# EAGLE design pneumatics (EAGLE 8.5.0)
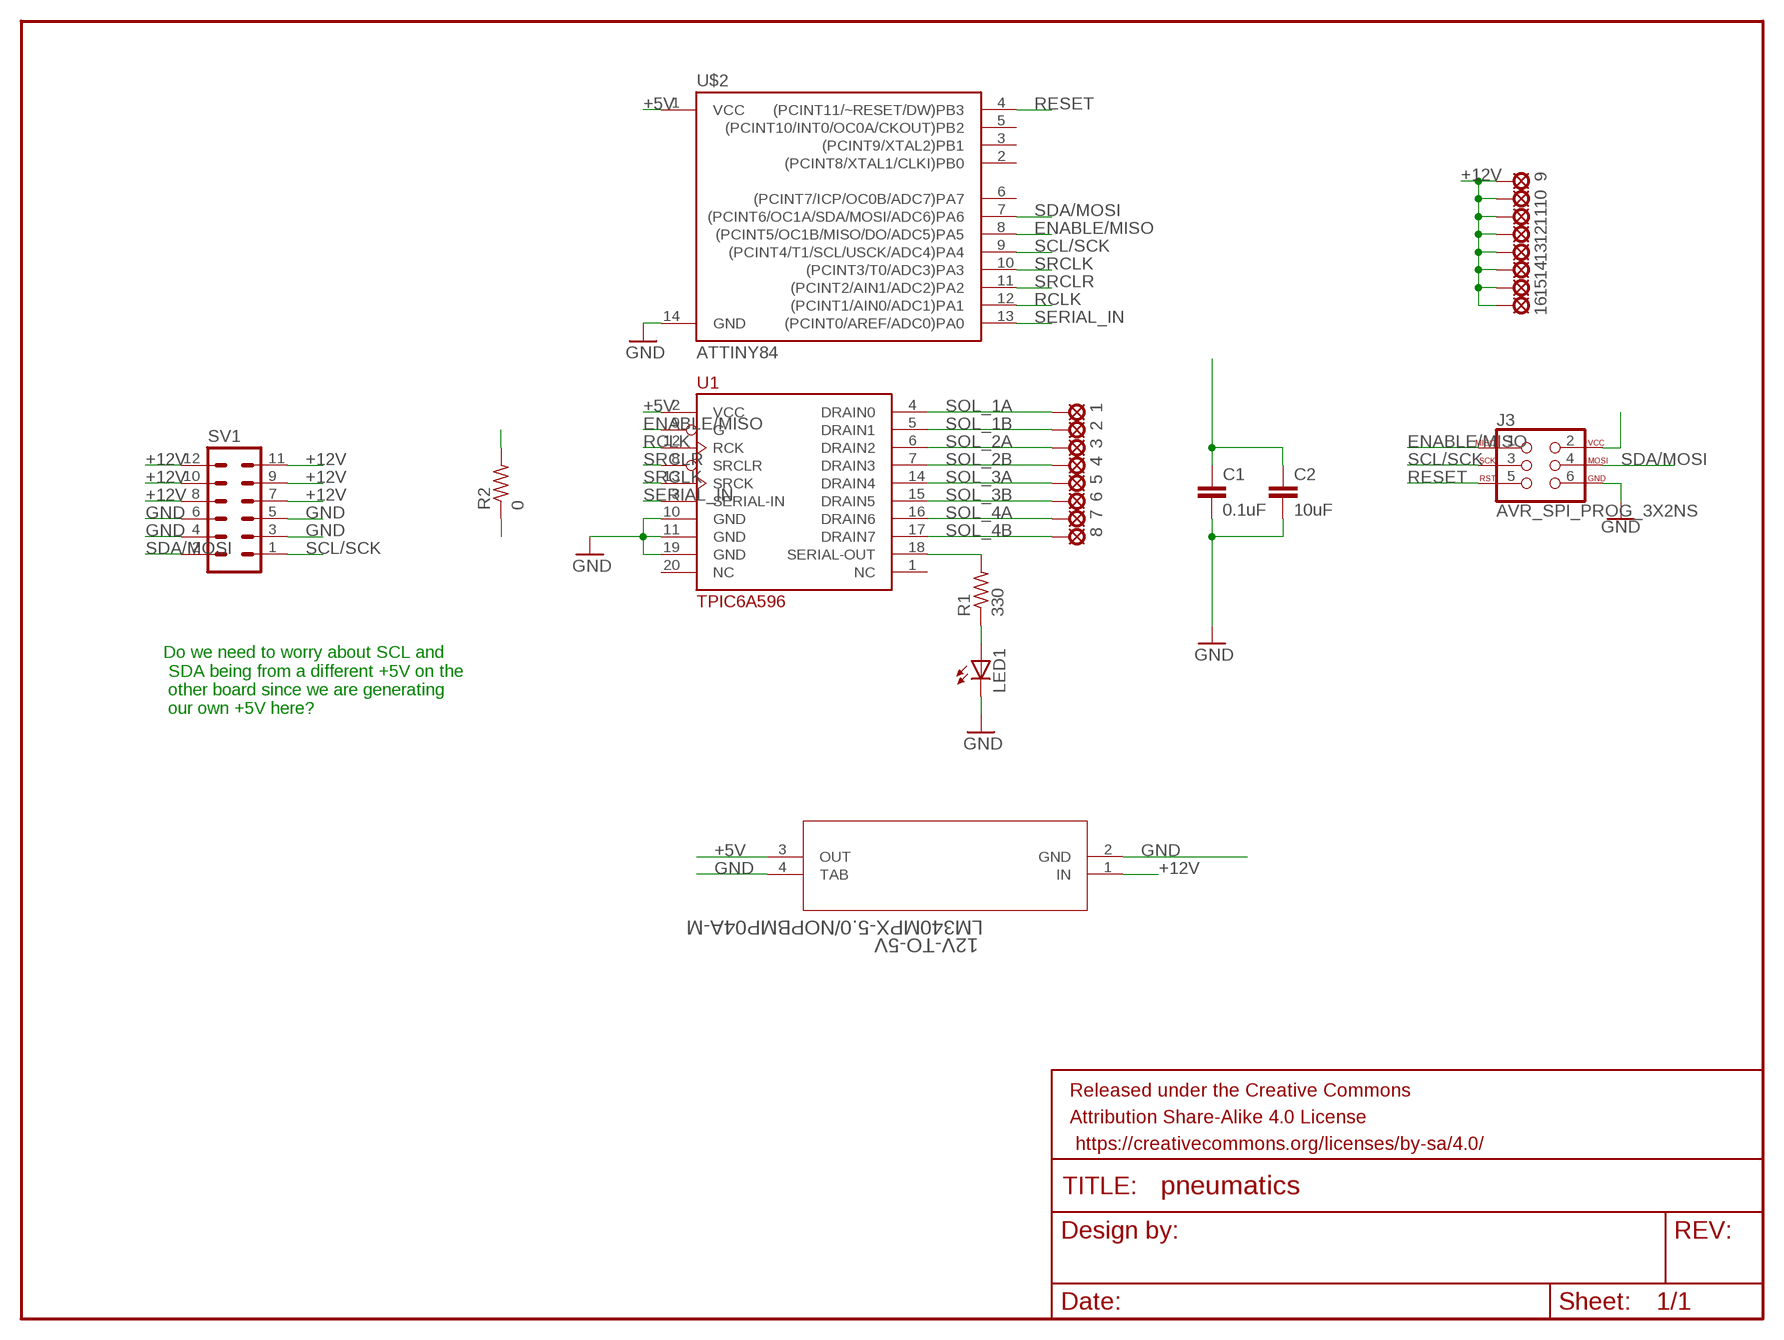
[diagram p0: schematic, sheet 1]

## Parts
1  SE14  [SE14]
2  SE14  [SE14]
3  SE14  [SE14]
4  SE14  [SE14]
5  SE14  [SE14]
6  SE14  [SE14]
7  SE14  [SE14]
8  SE14  [SE14]
9  SE14  [SE14]
10  SE14  [SE14]
11  SE14  [SE14]
12  SE14  [SE14]
12V-TO-5V  LM340MPX-5.0/NOPBMP04A-M  [MP04A-M]
13  SE14  [SE14]
14  SE14  [SE14]
15  SE14  [SE14]
16  SE14  [SE14]
C1  0.1uF  CAP0603-CAP  [0603-CAP]
C2  10uF  CAP0603-CAP  [0603-CAP]
FRAME1  FRAME-LETTERNO_PACKAGE  [DUMMY]
J3  AVR_SPI_PROG_3X2NS  [2X3-NS]
LED1  LED_ESML0603  [LED_SML0603]
R1  330  R-US_R0603  [R0603]
R2  0  R-US_R0603  [R0603]
SV1  MA06-2  [MA06-2]
U1  TPIC6A596  [SOIC20-W]
U$2  ATTINY84  [SO14]

## Nets
+5V: 12V-TO-5V.3(OUT) C1.1 C2.1 J3.2 U1.2(VCC) U$2.1(VCC)
+12V: 9.MP 10.MP 11.MP 12.MP 12V-TO-5V.1(IN) 13.MP 14.MP 15.MP 16.MP SV1.7 SV1.8 SV1.9 SV1.10 SV1.11 SV1.12
ENABLE/MISO: J3.1 U1.9(G) U$2.8((PCINT5/OC1B/MISO/DO/ADC5)PA5)
GND: 12V-TO-5V.2(GND) 12V-TO-5V.4(TAB) C1.2 C2.2 J3.6 LED1.C SV1.3 SV1.4 SV1.5 SV1.6 U1.10(GND) U1.11(GND) U1.19(GND) U$2.14(GND)
N$1: R1.2 U1.18(SERIAL-OUT)
N$7: LED1.A R1.1
RCLK: R2.2 U1.12(RCK) U$2.12((PCINT1/AIN0/ADC1)PA1)
RESET: J3.5 U$2.4((PCINT11/~RESET/DW)PB3)
SCL/SCK: J3.3 SV1.1 U$2.9((PCINT4/T1/SCL/USCK/ADC4)PA4)
SDA/MOSI: J3.4 SV1.2 U$2.7((PCINT6/OC1A/SDA/MOSI/ADC6)PA6)
SERIAL_IN: U1.3(SERIAL-IN) U$2.13((PCINT0/AREF/ADC0)PA0)
SOL_1A: 1.MP U1.4(DRAIN0)
SOL_1B: 2.MP U1.5(DRAIN1)
SOL_2A: 3.MP U1.6(DRAIN2)
SOL_2B: 4.MP U1.7(DRAIN3)
SOL_3A: 5.MP U1.14(DRAIN4)
SOL_3B: 6.MP U1.15(DRAIN5)
SOL_4A: 7.MP U1.16(DRAIN6)
SOL_4B: 8.MP U1.17(DRAIN7)
SRCLK: R2.1 U1.13(SRCK) U$2.10((PCINT3/T0/ADC3)PA3)
SRCLR: U1.8(SRCLR) U$2.11((PCINT2/AIN1/ADC2)PA2)
Unconnected: U1.1(NC) U1.20(NC) U$2.2((PCINT8/XTAL1/CLKI)PB0) U$2.3((PCINT9/XTAL2)PB1) U$2.5((PCINT10/INT0/OC0A/CKOUT)PB2) U$2.6((PCINT7/ICP/OC0B/ADC7)PA7)

## Notes on the sheet
- Do we need to worry about SCL and
   SDA being from a different +5V on the
   other board since we are generating
   our own +5V here?

## Library data of the parts
1-16 = solpad:SE14: SOLDER PAD E1553, drill 1,4mm, distributor Buerklin, 07F820
12V-TO-5V = 12v_to_5v_linreg:LM340MPX-5.0/NOPB; MANUFACTURER_PART_NUMBER: LM340MPX5.0NOPB; VENDOR: National Semiconductor
C1 C2 = SparkFun-Passives:CAP: Capacitor Standard 0603 ceramic capacitor, and 0.1" leaded capacitor.
FRAME1 = SparkFun-Aesthetics:FRAME-LETTER: Schematic Frame - Letter Standard 8.5x11 US Letter frame; DESIGNER: Nobody; VERSION: v01
J3 = SparkFun-Connectors:AVR_SPI_PROG_3X2: AVR ISP 6 Pin This is the reduced ISP connector for AVR programming. Common on Arduino. This footprint will take up less PCB space and can be used with a 10-pin to 6-pin adapter such as SKU: BOB-08508 **Special note about "TEST_POINT" package. The stop mask is on the top side, so if you want your programming test points to be on the bottom of your board, make sure to place this package on the bottom side of the board. This also ensure that the orientation to program from the bottom side will be correct. SparkFun Products: SparkFun ISP Pogo Adapter <https://www.sparkfun.com/products/11591> - NS Tiny AVR Programmer <https://www.sparkfun.com/products/11801> -PTH
LED1 = eagle-ltspice:LED_E: LED Source: http://www.osram.convergy.de Source: www.luxeon.com Source: www.kingbright.com; SPICEMODEL: NONE; SPICEPREFIX: D; SPICETYPE: diode
R1 R2 = resistor:R-US_: RESISTOR, American symbol
SV1 = con-lstb:MA06-2: PIN HEADER; OC_FARNELL: unknown; OC_NEWARK: unknown
U1 = Personal:TPIC6A596
U$2 = SparkFun-IC-Microcontroller:ATTINY84: Atmel 14-pin 2/4/8kB flash uC Datasheet <https://cdn.sparkfun.com/datasheets/Widgets/doc8006.pdf> SparkFun Products Tiny AVR Programmer <https://www.sparkfun.com/products/11801> (PGM-11801) SparkFun Servo Trigger - Continuous Rotation <https://www.sparkfun.com/products/13872> (WIG-13872) SparkFun Servo Trigger <https://www.sparkfun.com/products/13118> (WIG-13118); PROD_ID: IC-11285

## Board
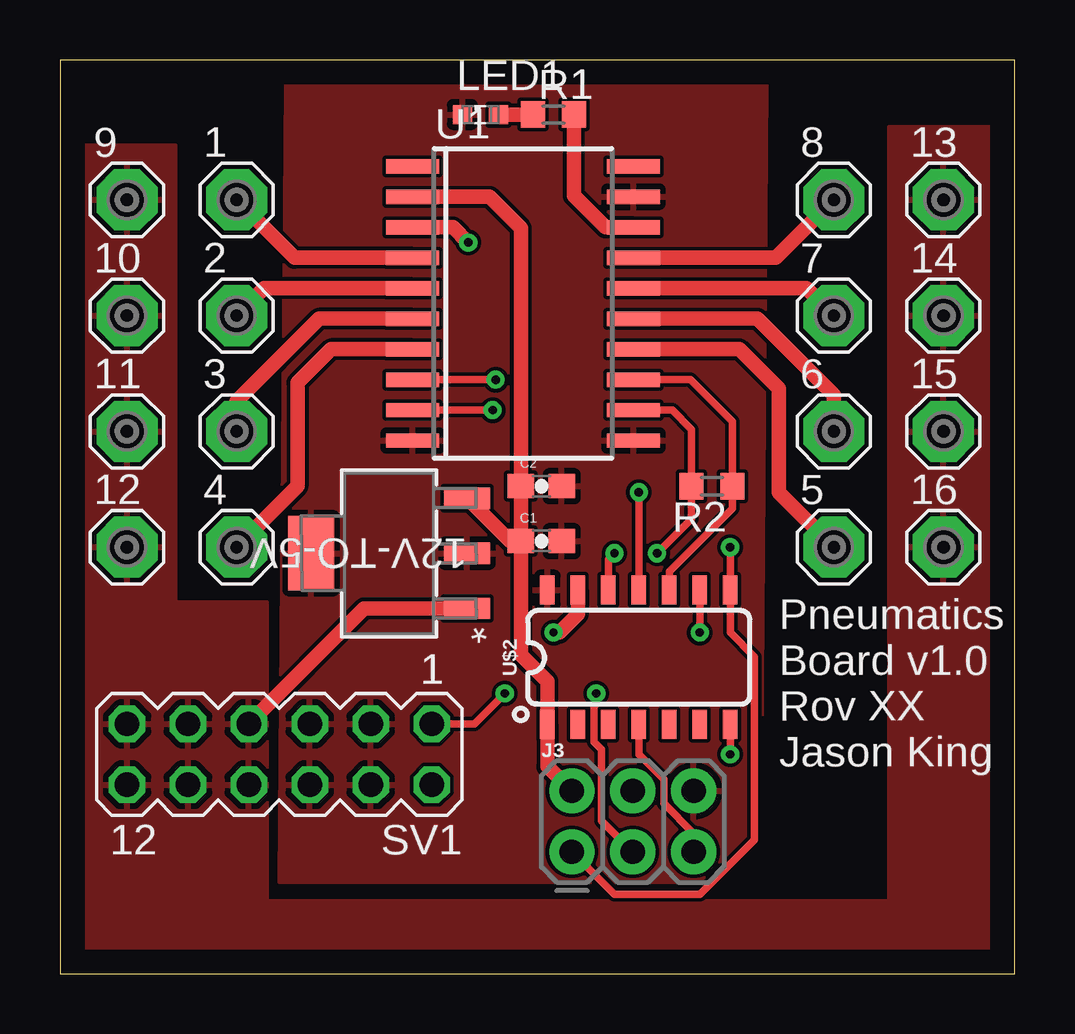
[diagram p1: board, top side]
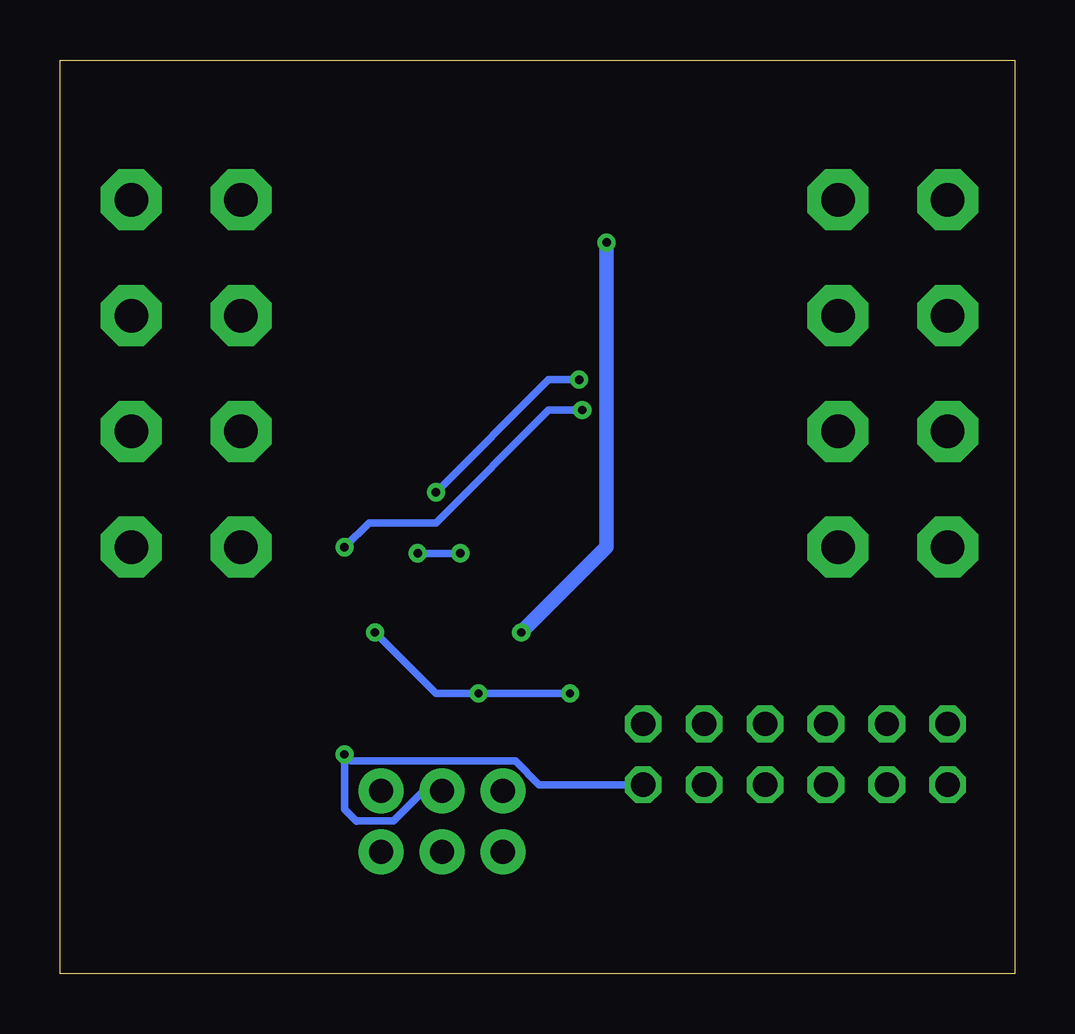
[diagram p2: board, bottom side, seen from below]

Size 39.8 x 38.09 mm. Coordinates in mm from the lower left corner, seen from the top.
Outline: 0,0 39.8,0 39.8,38.09 0,38.09 0,0
Copper layers (1*16): Top 0.035mm / dielectric 1.5mm / Bottom 0.035mm
Design rules "default": minimum track width 6mil, minimum drill 0.35mm, track to track 6mil, track to pad 6mil, pad to pad 6mil, via to via 6mil, smd to smd 6mil, copper to edge 40mil, drill to drill 6mil, minimum pad ring 10mil, minimum via ring 8mil, stop-mask expansion 4mil, vias tented up to drill 0mil, thermal gap 10mil

### Footprints (pad centres in the part's own frame; a part is rotated, then mirrored left to right if it is on the bottom)
SE14 = drill 1.397 pad 2.54 octagon: MP 0,0
MP04A-M = smd 1.905 x 0.889: 1 -3.251,2.3; 2 -3.251,0; 3 -3.251,-2.3 | smd 1.905 x 3.099: 4 3.251,0
0603-CAP = smd 1.1 x 1: 1 -0.85,0; 2 0.85,0
2X3-NS = drill 1.016 pad 1.88: 1 -2.54,-1.27; 2 -2.54,1.27; 3 0,-1.27; 4 0,1.27; 5 2.54,-1.27; 6 2.54,1.27
LED_SML0603 = smd 0.8 x 0.8: A 0.75,0; C -0.75,0
R0603 = smd 1 x 1.1: 1 -0.85,0; 2 0.85,0
MA06-2 = drill 1.016 octagon: 1 -6.35,-1.27; 2 -6.35,1.27; 3 -3.81,-1.27; 4 -3.81,1.27; 5 -1.27,-1.27; 6 -1.27,1.27; 7 1.27,-1.27; 8 1.27,1.27; 9 3.81,-1.27; 10 3.81,1.27; 11 6.35,-1.27; 12 6.35,1.27
SOIC20-W = smd 0.6 x 2.2: 1 -5.715,-4.6; 2 -4.445,-4.6; 3 -3.175,-4.6; 4 -1.905,-4.6; 5 -0.635,-4.6; 6 0.635,-4.6; 7 1.905,-4.6; 8 3.175,-4.6; 9 4.445,-4.6; 10 5.715,-4.6; 11 5.715,4.6; 12 4.445,4.6; 13 3.175,4.6; 14 1.905,4.6; 15 0.635,4.6; 16 -0.635,4.6; 17 -1.905,4.6; 18 -3.175,4.6; 19 -4.445,4.6; 20 -5.715,4.6
SO14 = smd 0.6 x 1.2: 1 -3.175,-2.8; 2 -1.905,-2.8; 3 -0.635,-2.8; 4 0.635,-2.8; 5 1.905,-2.8; 6 3.175,-2.8; 7 4.445,-2.8; 8 4.445,2.8; 9 3.175,2.8; 10 1.905,2.8; 11 0.635,2.8; 12 -0.635,2.8; 13 -1.905,2.8; 14 -3.175,2.8

### Placement (x,y rotation side)
1  7.37,32.26 0 top
2  7.37,27.43 0 top
3  7.37,22.61 0 top
4  7.37,17.78 0 top
5  32.26,17.78 0 top
6  32.26,22.61 0 top
7  32.26,27.43 0 top
8  32.26,32.26 0 top
9  2.79,32.26 0 top
10  2.79,27.43 0 top
11  2.79,22.61 0 top
12  2.79,17.78 0 top
12V-TO-5V  13.72,17.53 180 top
13  36.83,32.26 0 top
14  36.83,27.43 0 top
15  36.83,22.61 0 top
16  36.83,17.78 0 top
C1  20.07,18.03 0 top
C2  20.07,20.32 0 top
FRAME1  -27.94,34.29 0 top  (outside the outline)
J3  23.88,6.35 0 top
LED1  17.53,35.81 0 top
R1  20.57,35.81 0 top
R2  27.18,20.32 180 top
SV1  9.14,9.14 180 top
U1  19.3,27.94 270 top
U$2  23.5,13.2 0 top

### Tracks (layer width: path | path; a pad name or v marks a point on that pad's centre or on a via)
+5V
  Top 0.61: 12V-TO-5V.3 18.76,18.03 C1.1 | C1.1 C2.1 19.22,31.08 17.91,32.38 U1.2 | C1.1 19.22,13.3 20.32,12.19 U$2.1 20.32,8.64 J3.2
+12V
  Top 0.61: 12V-TO-5V.1 12.69,15.23 SV1.7
  pour Top: 0.25,34.54 0.25,0.25 39.88,0.25 39.88,35.31 34.54,35.31 34.54,3.05 8.89,3.05 8.64,3.05 8.64,15.49 4.83,15.49 4.83,34.54
ENABLE/MISO  (via drill 0.35)
  Top 0.305: U1.9 v18.03,23.5 | v27.94,17.78 U$2.8 27.94,14.22 28.96,13.21 28.96,5.59 26.67,3.3 23.11,3.3 J3.1
  Bottom 0.305: v18.03,23.5 19.43,23.5 24.13,18.8 26.92,18.8 v27.94,17.78
GND
  pour Top: 9.4,37.08 29.46,37.08 29.21,3.81 9.14,3.81
N$1
  Top 0.61: U1.18 22.73,31.11 21.42,32.42 R1.2
N$7
  Top 0.61: R1.1 LED1.A
RCLK  (via drill 0.35)
  Top 0.305: U1.12 25.53,23.5 26.33,22.69 R2.2 26.33,18.96 v24.89,17.53 | v23.11,17.53 22.86,17.27 U$2.12
  Bottom 0.305: v23.11,17.53 v24.89,17.53
RESET
  Top 0.305: J3.5 26.42,5.86 25.17,7.1 25.17,8.1 24.13,9.14 U$2.4
SCL/SCK  (via drill 0.35)
  Top 0.305: SV1.1 17.27,10.41 v18.54,11.68 | v26.67,14.22 U$2.9 | v22.35,11.68 22.35,11.22 22.25,11.12 22.25,9.67 22.58,9.34 22.58,6.38 J3.3
  Bottom 0.305: v18.54,11.68 v22.35,11.68 24.13,11.68 v26.67,14.22
SDA/MOSI  (via drill 0.35)
  Top 0.305: v27.94,9.14 U$2.7
  Bottom 0.305: SV1.2 19.83,7.87 20.82,8.87 27.66,8.87 v27.94,9.14 27.94,6.86 27.43,6.35 27.41,6.38 25.9,6.38 24.66,7.62 J3.4
SERIAL_IN  (via drill 0.35)
  Top 0.61: U$2.13 21.59,14.99 20.83,14.22 v20.57,14.22 | U1.3 16.38,31.11 v17.02,30.48
  Bottom 0.61: v20.57,14.22 17.02,17.78 v17.02,30.48
SOL_1A
  Top 0.61: U1.4 9.78,29.84 1.MP
SOL_1B
  Top 0.61: U1.5 8.51,28.57 2.MP
SOL_2A
  Top 0.61: U1.6 10.79,27.3 7.37,23.88 3.MP
SOL_2B
  Top 0.61: U1.7 11.3,26.04 9.91,24.64 9.91,20.32 4.MP
SOL_3A
  Top 0.61: U1.14 28.32,26.04 29.97,24.38 29.97,20.07 5.MP
SOL_3B
  Top 0.61: U1.15 29.08,27.3 32.26,24.13 6.MP
SOL_4A
  Top 0.61: U1.16 31.11,28.57 7.MP
SOL_4B
  Top 0.61: U1.17 29.84,29.84 8.MP
SRCLK
  Top 0.305: U1.13 26.29,24.77 28.03,23.03 R2.1 28.03,19.39 25.4,16.76 U$2.10
SRCLR  (via drill 0.35)
  Top 0.305: U1.8 v18.16,24.77 | v24.13,20.07 U$2.11
  Bottom 0.305: v18.16,24.77 19.43,24.77 v24.13,20.07

### Text on the board
tPlace: Pneumatics / Board v1.0 / Rov XX / Jason King